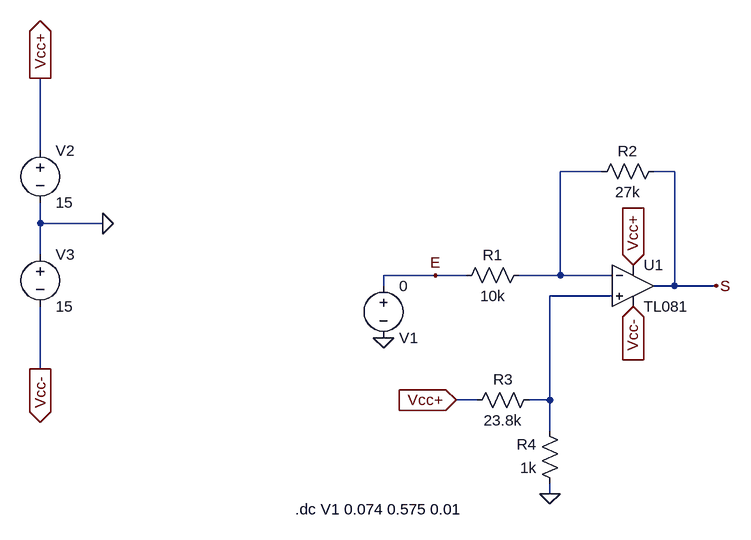
[diagram p0: schematic Conditionneur.asc]
Conditionneur.asc, the LTspice schematic file:
Version 4
SHEET 1 1624 680
WIRE -672 -48 -672 -160
WIRE 192 -16 128 -16
WIRE 304 -16 272 -16
WIRE -672 64 -672 32
WIRE -576 64 -672 64
WIRE -672 112 -672 64
WIRE -64 144 -144 144
WIRE -16 144 -64 144
WIRE 128 144 128 -16
WIRE 128 144 64 144
WIRE 208 144 128 144
WIRE -144 160 -144 144
WIRE 304 160 304 -16
WIRE 304 160 272 160
WIRE 368 160 304 160
WIRE 208 176 112 176
WIRE -672 288 -672 192
WIRE 0 336 -32 336
WIRE 112 336 112 176
WIRE 112 336 80 336
WIRE 112 384 112 336
WIRE 112 480 112 464
FLAG -144 240 0
FLAG -576 64 0
FLAG 240 128 Vcc+
IOPIN 240 128 In
FLAG 240 192 Vcc-
IOPIN 240 192 In
FLAG -672 -160 Vcc+
IOPIN -672 -160 Out
FLAG -672 288 Vcc-
IOPIN -672 288 Out
FLAG 368 160 S
FLAG -64 144 E
FLAG 112 480 0
FLAG -32 336 Vcc+
IOPIN -32 336 In
SYMBOL res 80 128 R90
WINDOW 0 0 56 VBottom 2
WINDOW 3 32 56 VTop 2
SYMATTR InstName R1
SYMATTR Value 10k
SYMBOL res 288 -32 R90
WINDOW 0 0 56 VBottom 2
WINDOW 3 32 56 VTop 2
SYMATTR InstName R2
SYMATTR Value 27k
SYMBOL voltage -672 -64 R0
WINDOW 123 0 0 Left 0
WINDOW 39 0 0 Left 0
SYMATTR InstName V2
SYMATTR Value 15
SYMBOL voltage -672 96 R0
WINDOW 123 0 0 Left 0
WINDOW 39 0 0 Left 0
SYMATTR InstName V3
SYMATTR Value 15
SYMBOL voltage -144 144 R0
WINDOW 0 24 96 Left 2
WINDOW 3 24 16 Left 2
WINDOW 123 0 0 Left 0
WINDOW 39 0 0 Left 0
SYMATTR InstName V1
SYMATTR Value 0
SYMBOL res 128 480 R180
WINDOW 0 36 76 Left 2
WINDOW 3 36 40 Left 2
SYMATTR InstName R4
SYMATTR Value 1k
SYMBOL res 96 320 R90
WINDOW 0 0 56 VBottom 2
WINDOW 3 32 56 VTop 2
SYMATTR InstName R3
SYMATTR Value 23.8k
SYMBOL TL081 240 96 R0
SYMATTR InstName U1
TEXT -280 504 Left 2 !.dc V1 0.074 0.575 0.01

The netlist it stands for:
* Conditionneur.asc
R1 N001 E 10k
R2 S N001 27k
V2 Vcc+ 0 15
V3 0 Vcc- 15
V1 E 0 0
R4 0 N002 1k
R3 N002 Vcc+ 23.8k
* U1: TL081 (symbol TL081 not available, pins judged from their places): In+=N002 In-=N001 V+=Vcc+ V-=Vcc- OUT=S
.dc V1 0.074 0.575 0.01
.backanno
.end